# Altium schematic sheet schematic.SchDoc
size A4; SheetNumber: 1; SheetTotal: 1
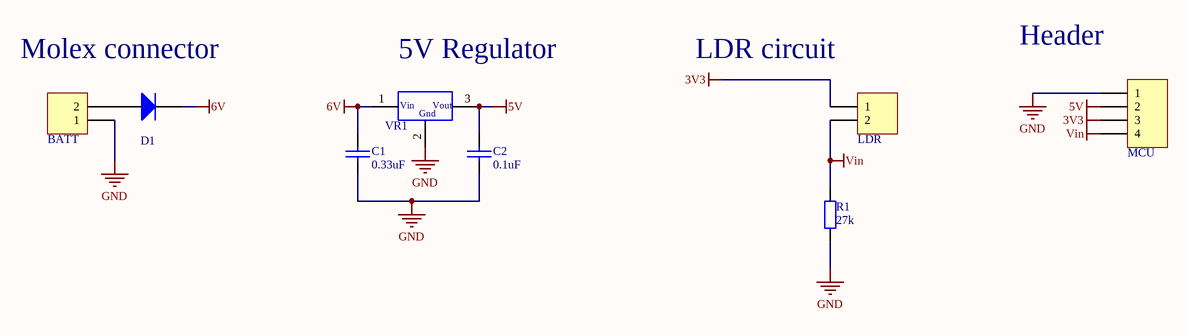
[diagram p0: schematic.SchDoc]

## Parts
BATT  2 Way  [ECE-600102STTH]  (value not drawn)
C1  0.33uF  [CCAP-5P0]
C2  0.1uF  [CCAP-5P0]
D1  1N4007  [1N4007-MFG]  (value not drawn)
LDR  2 Way  [ECE-600102STTH]  (value not drawn)
MCU  4 Way  [ECE-600104STTH]  (value not drawn)
R1  27k  [AXIAL-0.4]
VR1  L7805CV  [ECE-TO220ABTH]  (value not drawn)

## Nets
3V3: LDR.1 MCU.3
5V: C2.1 MCU.2 VR1.3(Vout)
6V: C1.1 D1.2(K) VR1.1(Vin)
GND: BATT.1 C1.2 C2.2 MCU.1 R1.1 VR1.2(Gnd)
Vin: LDR.2 MCU.4 R1.2
NetBATT_2: BATT.2 D1.1(A)

## Notes on the sheet
- Molex connector
- (near VR1) 5V Regulator
- (near LDR) LDR circuit
- (near MCU) Header

## Library data of the parts
BATT LDR = CON000001: HEADER POLARISED 2WAY TH; Manufactuer: GTK; Manufacturer-PN: 600102ST; Assembly Method: Through hole; Item Type: Item; Path: ece/ts/Lists/Stock Inventory; UoA Stock#: CON000001; Value: 2 Way; Size/Package: 2.54 Radial; Datasheet Link: http://share.engineering.auckland.ac.nz/ece/ts/Student%20Documents/polarised_connectors.pdf; Supplier1: Elecon; Supplier1-PN: YY3N02; Supplier2: Active Components; Supplier2-PN: 600102ST; Component Type: NA; Category: Connector; Status: Active
C1 C2 = CerCap_TH_5P0: TH ceramic capacitor with 5mm pitch; Value: *
D1 = 1N4007_TH_4AX0: 1N4007 1000V standard axial diode; ComponentLink1URL: https://www.fairchildsemi.com/datasheets/1N/1N914.pdf; ComponentLink1Description: https://www.fairchildsemi.com/datasheets/1N/1N914.pdf; Supplier 1: Digi-Key; Supplier Part Number 1: 1N4007RLGOSCT-ND
MCU = CON000003: HEADER POLARISED 4WAY TH; Manufactuer: GTK; Manufacturer-PN: 600104ST; Assembly Method: Through hole; Item Type: Item; Path: ece/ts/Lists/Stock Inventory; UoA Stock#: CON000003; Value: 4 Way; Size/Package: 2.54 Radial; Datasheet Link: http://share.engineering.auckland.ac.nz/ece/ts/Student%20Documents/polarised_connectors.pdf; Supplier1: Elecon; Supplier1-PN: YY3N04; Supplier2: Active Components; Supplier2-PN: 600104ST; Component Type: NA; Category: Connector; Status: Active
R1 = Res_TH_0AX4: Through hole resistor; Published: 8-Jun-2000; LatestRevisionDate: 17-Jul-2002; LatestRevisionNote: Re-released for DXP Platform.; PackageReference: AXIAL-0.4; Publisher: Altium Limited; Value: *; ComponentLink1Description: http://www.royalohm.com/pdf/product2017/PrecisionMetalMF.pdf
VR1 = REG000007: REG POSITIVE 5V TO220; Manufactuer: ST Microelectronics; Assembly Method: Through hole; Voltage/Current: 5V/1.5A; Item Type: Item; Path: ece/ts/Lists/Stock Inventory; Value: L7805CV; UoA Stock#: REG000007; Size/Package: TO220; Manufacturer-PN: L7805CV; Supplier1: Digikey; Supplier1-PN: 497-1443-5-ND; Category: Regulator; Status: Active